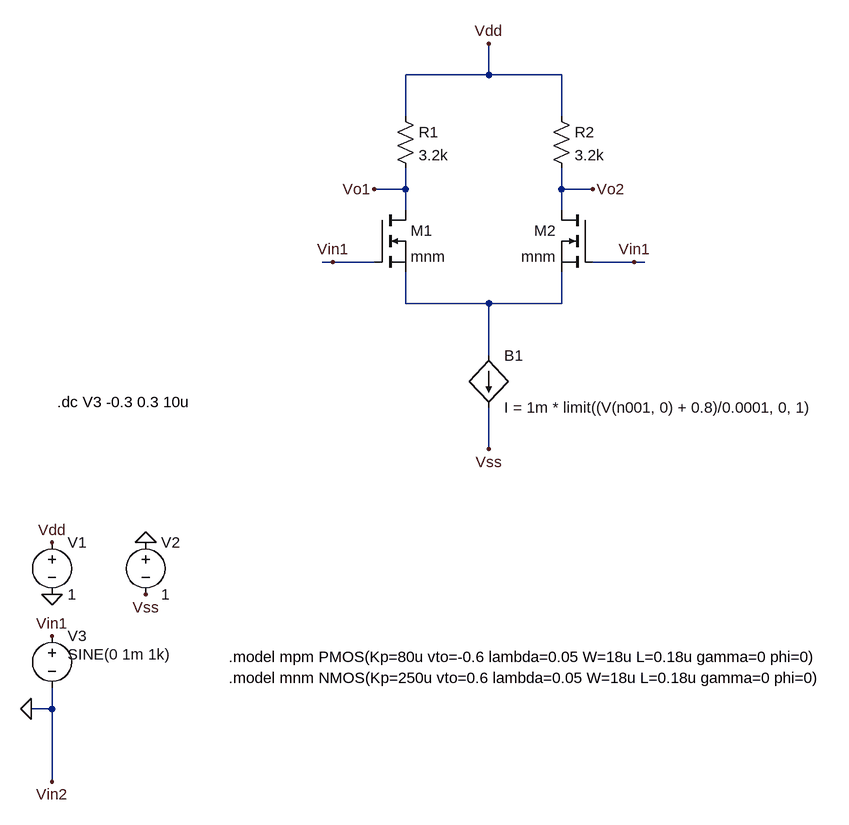
[diagram p0: schematic P1.asc]
P1.asc, the LTspice schematic file:
Version 4
SHEET 1 880 740
WIRE -160 -592 -160 -640
WIRE -160 -592 -288 -592
WIRE -48 -592 -160 -592
WIRE -288 -528 -288 -592
WIRE -48 -528 -48 -592
WIRE -288 -416 -288 -448
WIRE -288 -416 -336 -416
WIRE -48 -416 -48 -448
WIRE 0 -416 -48 -416
WIRE -288 -384 -288 -416
WIRE -48 -384 -48 -416
WIRE -400 -304 -416 -304
WIRE -336 -304 -400 -304
WIRE 64 -304 0 -304
WIRE 80 -304 64 -304
WIRE -288 -240 -288 -288
WIRE -160 -240 -288 -240
WIRE -48 -240 -48 -288
WIRE -48 -240 -160 -240
WIRE -160 -160 -160 -240
WIRE -160 -16 -160 -80
WIRE -832 384 -832 352
WIRE -832 384 -864 384
WIRE -832 496 -832 384
FLAG -832 208 0
FLAG -688 128 0
FLAG -832 272 Vin1
FLAG -832 128 Vdd
FLAG -688 208 Vss
FLAG -400 -304 Vin1
FLAG 64 -304 Vin1
FLAG -160 -640 Vdd
FLAG -160 -16 Vss
FLAG -864 384 0
FLAG -336 -416 Vo1
FLAG 0 -416 Vo2
FLAG -832 496 Vin2
SYMBOL nmos -336 -384 R0
SYMATTR InstName M1
SYMATTR Value mnm
SYMBOL nmos 0 -384 M0
SYMATTR InstName M2
SYMATTR Value mnm
SYMBOL res -304 -544 R0
SYMATTR InstName R1
SYMATTR Value 3.2k
SYMBOL res -64 -544 R0
SYMATTR InstName R2
SYMATTR Value 3.2k
SYMBOL voltage -832 112 R0
SYMATTR InstName V1
SYMATTR Value 1
SYMBOL voltage -688 112 R0
SYMATTR InstName V2
SYMATTR Value 1
SYMBOL voltage -832 256 R0
WINDOW 3 24 44 Left 2
WINDOW 123 24 72 Left 2
WINDOW 39 0 0 Left 0
SYMATTR Value SINE(0 1m 1k)
SYMATTR InstName V3
SYMBOL bi -160 -160 R0
SYMATTR InstName B1
SYMATTR Value I = 1m * limit((V(n001, 0) + 0.8)/0.0001, 0, 1)
TEXT -824 -88 Left 2 !.dc V3 -0.3 0.3 10u
TEXT -560 304 Left 2 !.model mpm PMOS(Kp=80u vto=-0.6 lambda=0.05 W=18u L=0.18u gamma=0 phi=0)
TEXT -560 336 Left 2 !.model mnm NMOS(Kp=250u vto=0.6 lambda=0.05 W=18u L=0.18u gamma=0 phi=0)

The netlist it stands for:
* P1.asc
M1 Vo1 Vin1 N001 N001 mnm
M2 Vo2 Vin1 N001 N001 mnm
R1 Vdd Vo1 3.2k
R2 Vdd Vo2 3.2k
V1 Vdd 0 1
V2 0 Vss 1
V3 Vin1 0 SINE(0 1m 1k)
B1 N001 Vss I = 1m * limit((V(n001, 0) + 0.8)/0.0001, 0, 1)
.model NMOS NMOS
.model PMOS PMOS
.lib standard.mos
.dc V3 -0.3 0.3 10u
.model mpm PMOS(Kp=80u vto=-0.6 lambda=0.05 W=18u L=0.18u gamma=0 phi=0)
.model mnm NMOS(Kp=250u vto=0.6 lambda=0.05 W=18u L=0.18u gamma=0 phi=0)
.backanno
.end